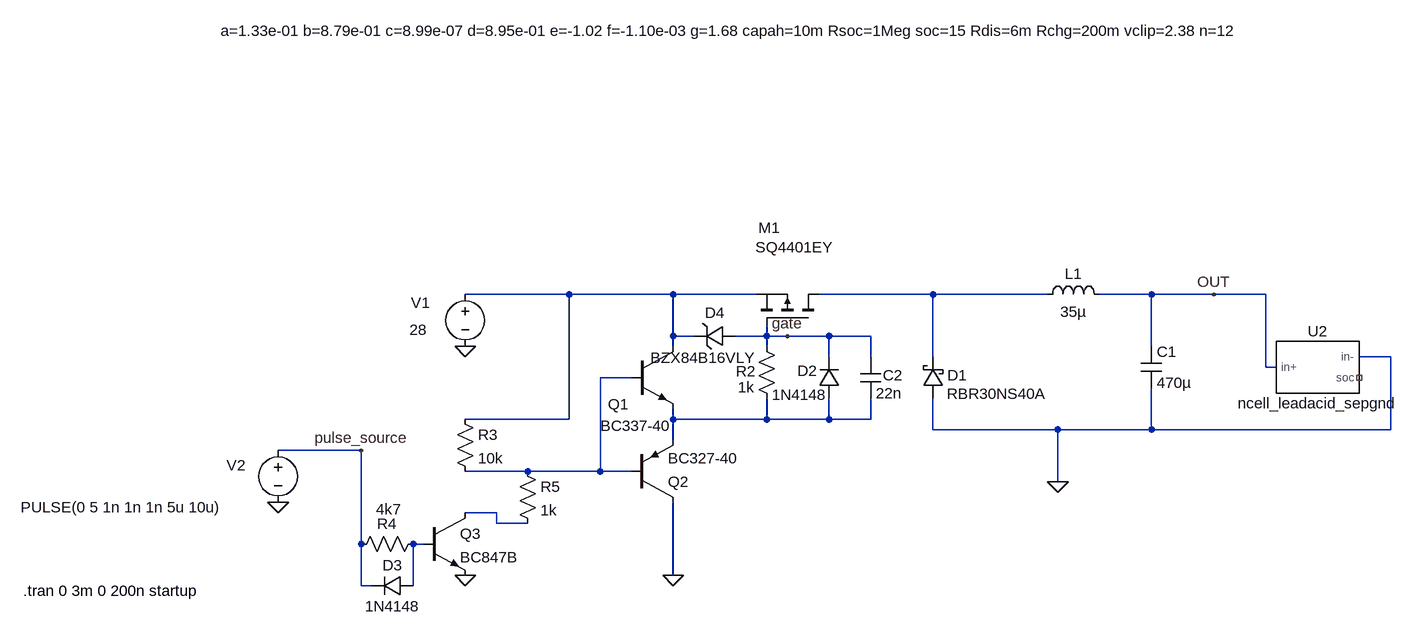
[diagram p0: schematic smps.asc]
smps.asc, the LTspice schematic file:
Version 4
SHEET 1 1708 680
WIRE -352 32 -512 32
WIRE -192 32 -352 32
WIRE -64 32 -192 32
WIRE 208 32 32 32
WIRE 384 32 208 32
WIRE 544 32 464 32
WIRE 640 32 544 32
WIRE 720 32 640 32
WIRE -192 96 -192 32
WIRE -160 96 -192 96
WIRE -48 96 -48 80
WIRE -48 96 -96 96
WIRE -16 96 -48 96
WIRE 48 96 -16 96
WIRE 112 96 48 96
WIRE -192 112 -192 96
WIRE -48 112 -48 96
WIRE 544 112 544 32
WIRE 48 128 48 96
WIRE 112 128 112 96
WIRE 208 128 208 32
WIRE 912 128 864 128
WIRE 720 144 720 32
WIRE 736 144 720 144
WIRE -256 160 -304 160
WIRE -352 224 -352 32
WIRE -352 224 -512 224
WIRE -192 224 -192 208
WIRE -48 224 -48 192
WIRE -48 224 -192 224
WIRE 48 224 48 192
WIRE 48 224 -48 224
WIRE 112 224 112 192
WIRE 112 224 48 224
WIRE 208 240 208 192
WIRE 400 240 208 240
WIRE 544 240 544 176
WIRE 544 240 400 240
WIRE 912 240 912 128
WIRE 912 240 544 240
WIRE -192 256 -192 224
WIRE -672 272 -800 272
WIRE -416 304 -512 304
WIRE -304 304 -304 160
WIRE -304 304 -416 304
WIRE -256 304 -304 304
WIRE 400 320 400 240
WIRE -464 368 -512 368
WIRE -464 384 -464 368
WIRE -416 384 -464 384
WIRE -672 416 -672 272
WIRE -576 416 -592 416
WIRE -192 464 -192 352
WIRE -672 480 -672 416
WIRE -656 480 -672 480
WIRE -592 480 -592 416
FLAG -192 464 0
FLAG 400 320 0
FLAG -512 112 0
FLAG -800 352 0
FLAG -512 464 0
FLAG 640 32 OUT
FLAG -672 272 pulse_source
FLAG -16 96 gate
SYMBOL schottky 224 192 R180
WINDOW 0 -37 36 Left 2
WINDOW 3 -158 7 Left 2
SYMATTR InstName D1
SYMATTR Value RBR30NS40A
SYMBOL pmos 32 80 M270
WINDOW 0 151 93 VLeft 2
WINDOW 3 121 97 VLeft 2
SYMATTR InstName M1
SYMATTR Value SQ4401EY
SYMBOL ind 368 48 R270
WINDOW 0 32 56 VTop 2
WINDOW 3 5 56 VBottom 2
SYMATTR InstName L1
SYMATTR Value 35µ
SYMBOL cap 528 112 R0
SYMATTR InstName C1
SYMATTR Value 470µ
SYMBOL npn -256 112 R0
WINDOW 0 -36 89 Left 2
WINDOW 3 -48 122 Left 2
SYMATTR InstName Q1
SYMATTR Value BC337-40
SYMBOL pnp -256 352 M180
SYMATTR InstName Q2
SYMATTR Value BC327-40
SYMBOL res -64 96 R0
WINDOW 0 -31 54 Left 2
WINDOW 3 -28 79 Left 2
SYMATTR InstName R2
SYMATTR Value 1k
SYMBOL voltage -512 16 R0
WINDOW 0 -83 29 Left 2
WINDOW 3 -86 70 Left 2
WINDOW 123 0 0 Left 0
WINDOW 39 0 0 Left 0
SYMATTR InstName V1
SYMATTR Value 28
SYMBOL voltage -800 256 R0
WINDOW 0 -79 39 Left 2
WINDOW 3 -396 103 Left 2
WINDOW 123 0 0 Left 0
WINDOW 39 0 0 Left 0
SYMATTR InstName V2
SYMATTR Value PULSE(0 5 1n 1n 1n 5u 10u)
SYMBOL npn -576 368 R0
SYMATTR InstName Q3
SYMATTR Value BC847B
SYMBOL res -528 208 R0
SYMATTR InstName R3
SYMATTR Value 10k
SYMBOL res -576 400 R90
WINDOW 0 0 56 VBottom 2
WINDOW 3 -53 54 VTop 2
SYMATTR InstName R4
SYMATTR Value 4k7
SYMBOL zener -96 80 R90
WINDOW 0 -4 32 VBottom 2
WINDOW 3 34 50 VTop 2
SYMATTR InstName D4
SYMATTR Value BZX84B16VLY
SYMATTR Description Diode
SYMATTR Type diode
SYMBOL diode 64 192 R180
WINDOW 0 34 43 Left 2
WINDOW 3 19 6 Left 2
SYMATTR InstName D2
SYMATTR Value 1N4148
SYMBOL cap 96 128 R0
WINDOW 0 35 28 Left 2
SYMATTR InstName C2
SYMATTR Value 22n
SYMBOL diode -592 464 R90
WINDOW 0 0 32 VBottom 2
WINDOW 3 32 32 VTop 2
SYMATTR InstName D3
SYMATTR Value 1N4148
SYMBOL res -432 288 R0
SYMATTR InstName R5
SYMATTR Value 1k
SYMBOL ncell_leadacid_sepgnd 800 144 R0
WINDOW 39 -892 -533 Top 2
SYMATTR InstName U2
SYMATTR SpiceLine a=1.33e-01 b=8.79e-01 c=8.99e-07 d=8.95e-01 e=-1.02 f=-1.10e-03 g=1.68 capah=10m Rsoc=1Meg soc=15 Rdis=6m Rchg=200m vclip=2.38 n=12
TEXT -1192 488 Left 2 !.tran 0 3m 0 200n startup

The netlist it stands for:
* smps.asc
D1 0 N002 RBR30NS40A
M1 N002 gate N001 N001 SQ4401EY
L1 N002 OUT 35µ
C1 OUT 0 470µ
Q1 N001 N003 N004 0 BC337-40
Q2 0 N003 N004 0 BC327-40
R2 gate N004 1k
V1 N001 0 28
V2 pulse_source 0 PULSE(0 5 1n 1n 1n 5u 10u)
Q3 N005 N006 0 0 BC847B
R3 N001 N003 10k
R4 N006 pulse_source 4k7
D4 gate N001 BZX84B16VLY
D2 N004 gate 1N4148
C2 gate N004 22n
D3 N006 pulse_source 1N4148
R5 N003 N005 1k
XU2 OUT 0 NC_01 ncell_leadacid_sepgnd a=1.33e-01 b=8.79e-01 c=8.99e-07 d=8.95e-01 e=-1.02 f=-1.10e-03 g=1.68 capah=10m Rsoc=1Meg soc=15 Rdis=6m Rchg=200m vclip=2.38 n=12  ; pins in+ in- soc
.model D D
.lib standard.dio
.model NPN NPN
.model PNP PNP
.lib standard.bjt
.model NMOS NMOS
.model PMOS PMOS
.lib standard.mos
.tran 0 3m 0 200n startup
.lib D:\BMS-and-offgrid-photovoltaic-management-system\simulation\models\leadAcid_ncell_sep_gnd.lib
.backanno
.end